# Altium schematic sheet J-K-Flip-Flop.SchDoc: J-K-Flip-Flop
size A4; Revision: 1; SheetNumber: 1; SheetTotal: 1; PartNumber: PNxxx; Drawn By: Sebastian Kulik
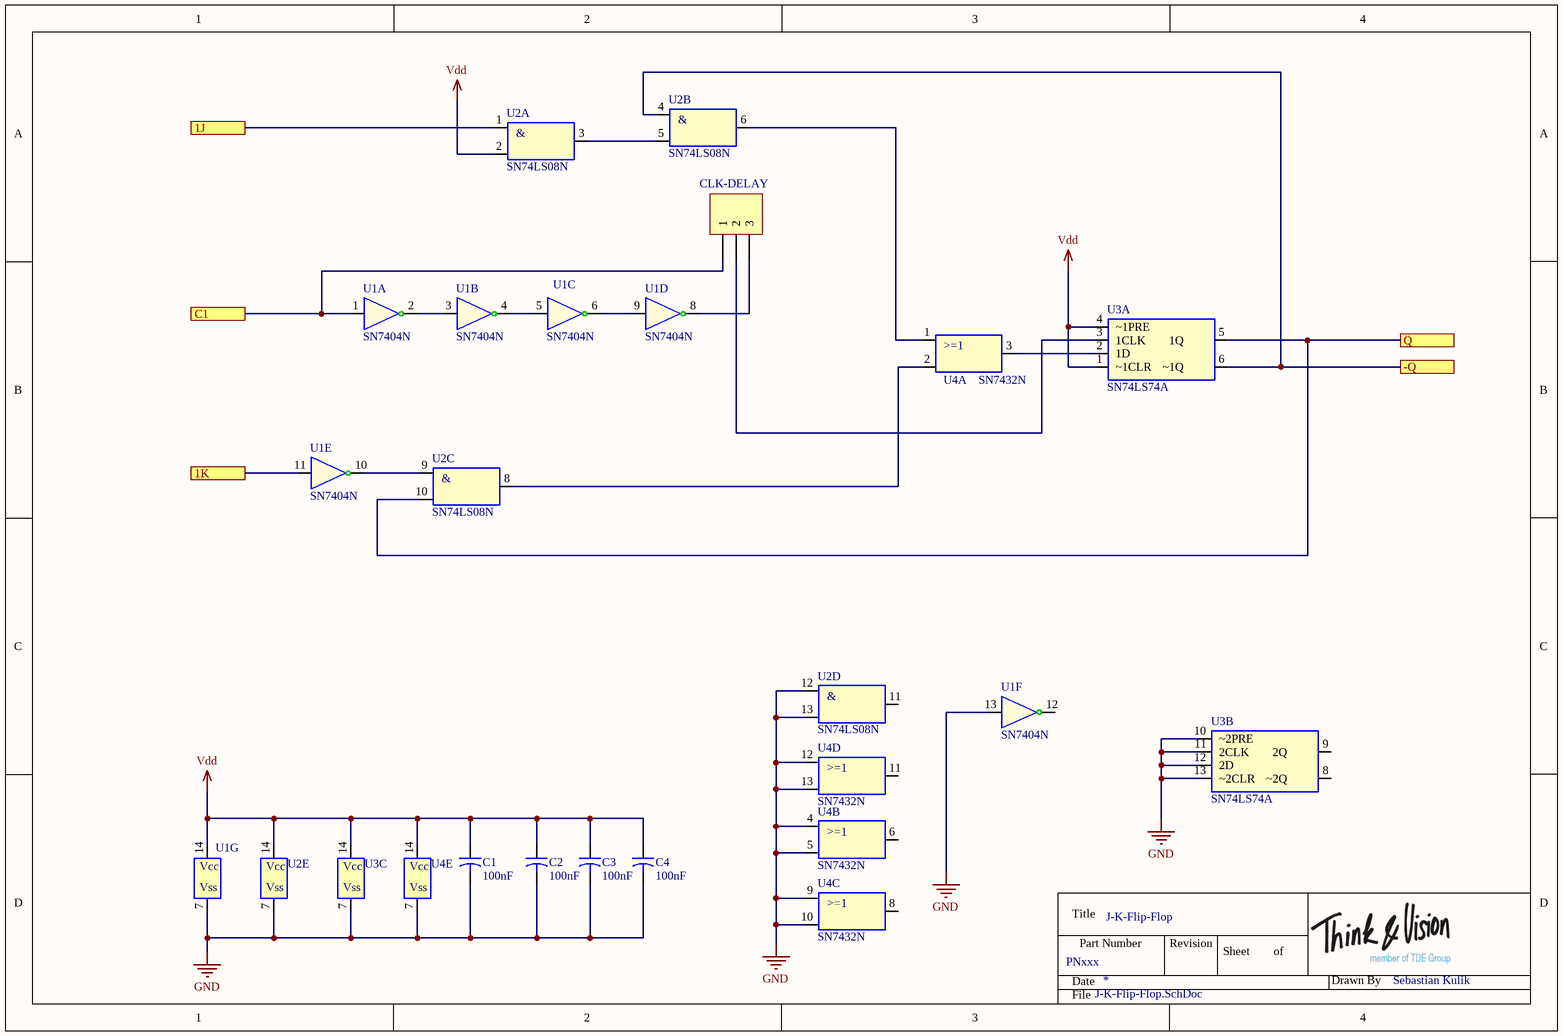
[diagram p0: J-K-Flip-Flop.SchDoc]

## Parts
C1  value 100nF  [Dummy-10mm]  (hidden comment: Capacitor-Dummy-THT)
C2  value 100nF  [Dummy-10mm]  (hidden comment: Capacitor-Dummy-THT)
C3  value 100nF  [Dummy-10mm]  (hidden comment: Capacitor-Dummy-THT)
C4  value 100nF  [Dummy-10mm]  (hidden comment: Capacitor-Dummy-THT)
CLK-DELAY  Plug_3_90_2.54  [HDR1X3]  (value not drawn)
U1  SN7404N  [DIP-14]  (parts A,B,C,D,E,F,G of 7)
U2  SN74LS08N  [DIP-14]  (parts A,B,C,D,E of 5)
U3  SN74LS74A  [DIP-14]  (parts A,B,C of 3)
U4  SN7432N  [DIP-14]  (parts A,B,C,D,E of 5)

## Ports
1J, 1K, -Q, C1, Q

## Nets
GND: C1.2 C2.2 C3.2 C4.2 U1.7(Vss) U1.13(6A) U2.7(Vss) U2.12(4A) U2.13(4B) U3.7(Vss) U3.10(~2PRE) U3.11(2CLK) U3.12(2D) U3.13(~2CLR) U4.4(2A) U4.5(2B) U4.7(Vss) U4.9(3A) U4.10(3B) U4.12(4A) U4.13(4B)
Vdd: C1.1 C2.1 C3.1 C4.1 U1.14(Vcc) U2.2(1B) U2.14(Vcc) U3.1(~1CLR) U3.4(~1PRE) U3.14(Vcc) U4.14(Vcc)
1J: U2.1(1A) ; port 1J
1K: U1.11(5A) ; port 1K
-Q: U2.4(2A) U3.6(~1Q) ; port -Q
C1: CLK-DELAY.1 U1.1(1A) ; port C1
Q: U2.10(3B) U3.5(1Q) ; port Q
NetCLK-DELAY_2: CLK-DELAY.2 U3.3(1CLK)
NetCLK-DELAY_3: CLK-DELAY.3 U1.8(Y4)
NetU1_2: U1.2(1Y) U1.3(2A)
NetU1_4: U1.4(2Y) U1.5(3A)
NetU1_6: U1.6(3Y) U1.9(4A)
NetU1_10: U1.10(5Y) U2.9(3A)
NetU2_3: U2.3(Y1) U2.5(2B)
NetU2_6: U2.6(Y2) U4.1(1A)
NetU2_8: U2.8(Y3) U4.2(1B)
NetU3_2: U3.2(1D) U4.3(Y1)

Not connected (* = marked no-connect by the designer): U1 12(6Y); U2 11(Y4); U3 8(~2Q) 9(2Q); U4 6(Y2) 8(Y3) 11(Y4)

## Notes on the sheet
- Title
- Date
- Part Number
- Revision
- Sheet
- of
- Drawn By
- File
- (in symbol SN74LS08N, part A) &
- (in symbol SN74LS08N, part B) &
- (in symbol SN74LS08N, part C) &
- (in symbol SN74LS08N, part D) &
- (in symbol SN7432N, part A) >=1
- (in symbol SN7432N, part B) >=1
- (in symbol SN7432N, part C) >=1
- (in symbol SN7432N, part D) >=1

## Library data of the parts
C1-C4 = Capacitor-Dummy-THT: Deliverer PartNr: 721-5240; Deliverer: RS; Published: 08.12.2015; Part Description: Capacitor-Dummy-THT; Publisher: Sebastian Kulik; PackageDescription: -; Manufacturer: -; Manufacturer PartNr: -; TDE-PN: -; Price: 0.081/50
CLK-DELAY = Plug_3_90_2.54: Plug,-3-Pin; Manufacturer: WE; Manufacturer PartNr: 61300311021; Deliverer PartNr: 828-1585; Deliverer: RS; TDE-PN: CON0011; Publisher: Sebastian Kulik; Price: 0.138/5
U1 = SN7404N: Hex Inverter TTL; Deliverer PartNr: 305-529; Manufacturer: TI; Deliverer: RS; TDE-PN: IC0086; Published: 24.11.2016; PackageDescription: DIP14; Publisher: Sebastian Kulik; Manufacturer PartNr: SN7404N; Price: 1
U2 = SN74LS08N: Quad AND, TTL; Deliverer PartNr: 307-519; Manufacturer: TI; Deliverer: RS; TDE-PN: IC0088; Published: 24.11.2016; PackageDescription: DIP14; Publisher: Sebastian Kulik; Manufacturer PartNr: SN74LS08N; Price: 0.56
U3 = SN74LS74A: Flip-Flop Dual, TTL; Deliverer PartNr: 307-597; Manufacturer PartNr: SN74LS74AN; Manufacturer: TI; Deliverer: RS; TDE-PN: IC0089; Published: 24.11.2016; PackageDescription: DIP14; Publisher: Sebastian Kulik; Price: 0.48
U4 = SN7432N: Quad NAND, TTL; Deliverer PartNr: 304-093; Manufacturer: TI; Deliverer: RS; TDE-PN: IC0087; Published: 24.11.2016; PackageDescription: DIP14; Publisher: Sebastian Kulik; Manufacturer PartNr: SN7432N; Price: 1.24